# Altium schematic sheet 05 MISC.SchDoc
size 420 x 297 mm
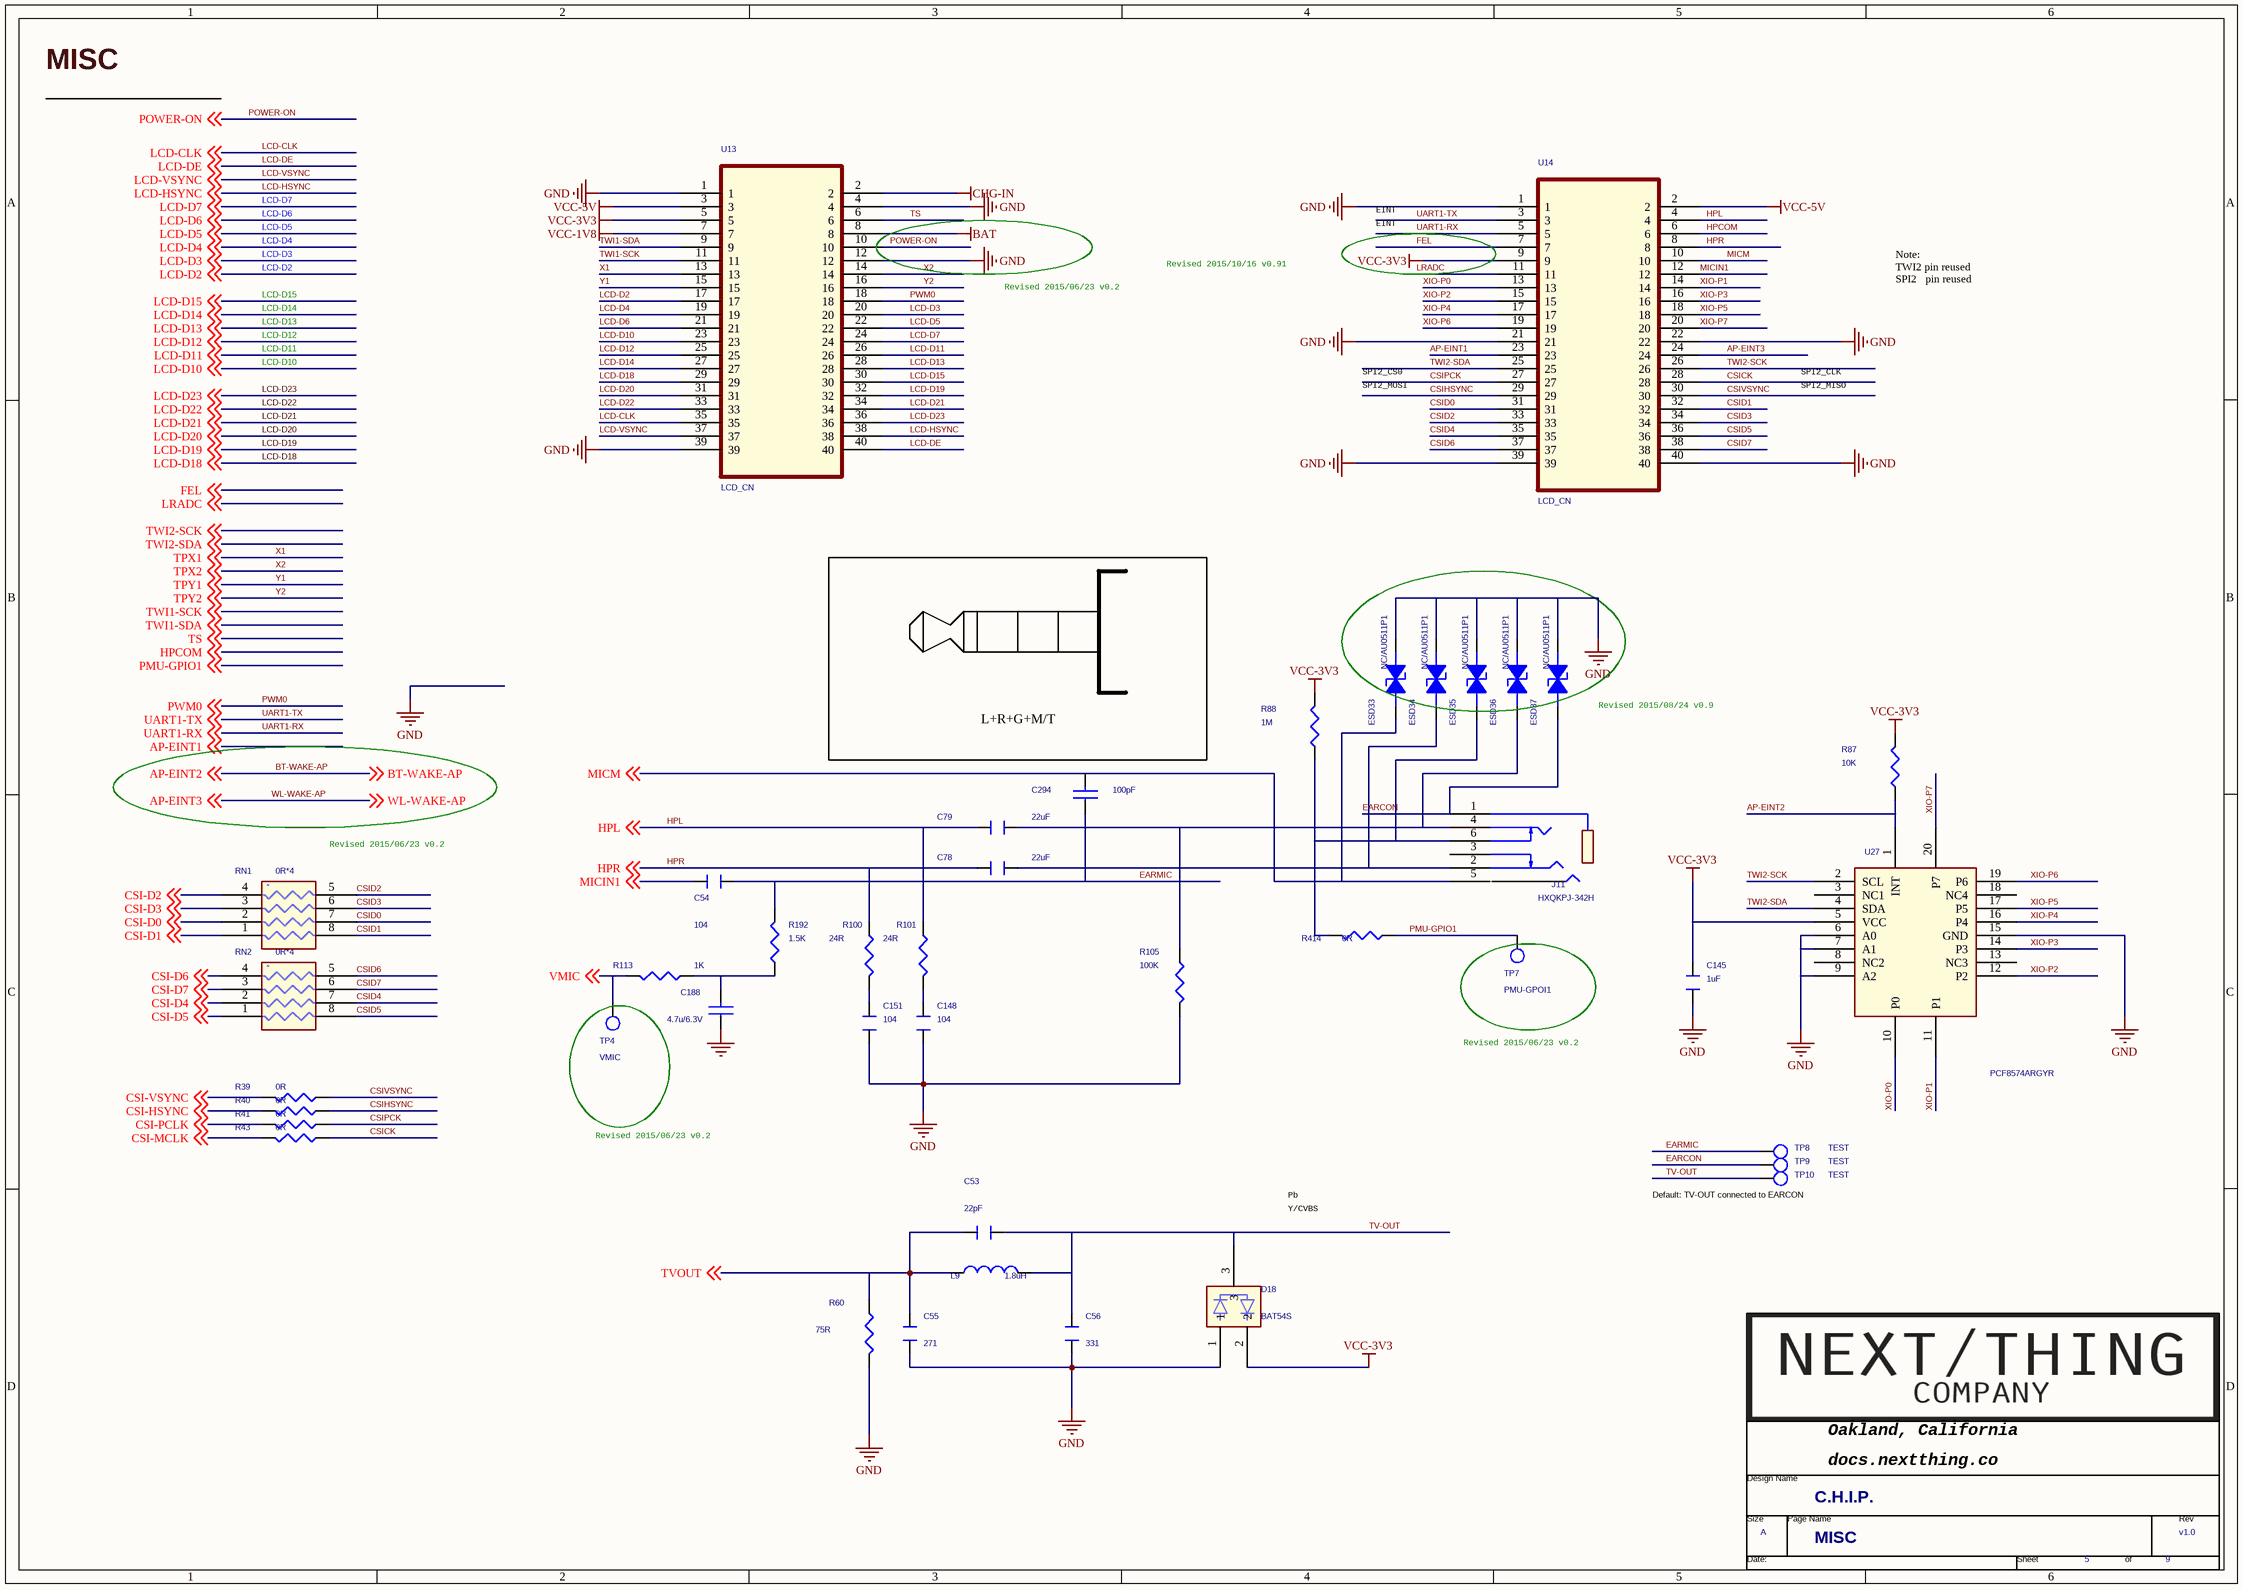
[diagram p0: 05 MISC.SchDoc]

## Parts
*  Page Count: 9  Page Number: 5  Page Size: A  Title: C.H.I.P.  RevCode: v1.0  Doc: MISC  (hidden comment: TitleBlock1-nextthing)  (graphical)
C53  22pF  [C0201]
C54  104  [C0201]
C55  271  [C0201]
C56  331  [C0201]
C78  22uF  [CC0805]
C79  22uF  [CC0805]
C145  1uF  [CC0402]
C148  104  [C0201]
C151  104  [C0201]
C188  4.7u/6.3V  [CC0603]
C294  100pF  [C0201]
D18  BAT54S  [SOT-23]
ESD33  NC/AU0511P1  [R0402]
ESD34  NC/AU0511P1  [R0402]
ESD35  NC/AU0511P1  [R0402]
ESD36  NC/AU0511P1  [R0402]
ESD37  NC/AU0511P1  [R0402]
J11  HXQKPJ-342H  [TSH-3865D]
L9  1.8uH  [L0603]
R39  0R  [R0603]
R40  0R  [R0603]
R41  0R  [R0603]
R43  0R  [R0603]
R60  75R  [C0201]
R87  10K  [C0201]
R88  1M  [C0201]
R100  24R  [R0402]
R101  24R  [R0402]
R105  100K  [R0402]
R113  1K  [C0201]
R192  1.5K  [C0201]
R414  0R  [0805]
RN1  0R*4  [RN0201]
RN2  0R*4  [RN0201]
TP4  VMIC  [TP40_SMD]
TP7  PMU-GPOI1  [TP40_SMD]
TP8  TEST  [TP30_SMD]
TP9  TEST  [TP30_SMD]
TP10  TEST  [TP30_SMD]
U13  LCD_CN  [CON2X20-PT2_54-5_2X31_2H2A]
U14  LCD_CN  [CON2X20-PT2_54-5_2X31_2H2A]
U27  PCF8574ARGYR  [SO16]

## Nets
BAT: U13.8
CHG-IN: U13.2
GND: C55.1 C56.1 C145.1 C148.2 C151.2 C188.1 D18.1 ESD33.1(ANODE) ESD34.1(ANODE) ESD35.1(ANODE) ESD36.1(ANODE) ESD37.1(ANODE) R60.2 R105.2 U13.1 U13.4 U13.12 U13.39 U14.1 U14.21 U14.22 U14.39 U14.40 U27.6(A0) U27.7(A1) U27.9(A2) U27.15(GND)
VCC-1V8: U13.7
VCC-3V3: C145.2 D18.2 R87.2 R88.2 U13.5 U14.9 U27.5(VCC)
VCC-5V: U13.3 U14.2
AP-EINT1: U14.23 ; off-sheet AP-EINT1
AP-EINT2: R87.1 U27.1(INT) ; off-sheet AP-EINT2, off-sheet BT-WAKE-AP  [also labelled BT-WAKE-AP]
AP-EINT3: U14.24 ; off-sheet AP-EINT3, off-sheet WL-WAKE-AP  [also labelled WL-WAKE-AP]
CSI-D0: RN1.2(R2) ; off-sheet CSI-D0
CSI-D1: RN1.1(R1) ; off-sheet CSI-D1
CSI-D2: RN1.4(R4) ; off-sheet CSI-D2
CSI-D3: RN1.3(R3) ; off-sheet CSI-D3
CSI-D4: RN2.2(R2) ; off-sheet CSI-D4
CSI-D5: RN2.1(R1) ; off-sheet CSI-D5
CSI-D6: RN2.4(R4) ; off-sheet CSI-D6
CSI-D7: RN2.3(R3) ; off-sheet CSI-D7
CSI-HSYNC: R40.1 ; off-sheet CSI-HSYNC
CSI-MCLK: R43.2 ; off-sheet CSI-MCLK
CSI-PCLK: R41.1 ; off-sheet CSI-PCLK
CSI-VSYNC: R39.1 ; off-sheet CSI-VSYNC
CSICK: R43.1 U14.28
CSID0: RN1.7(R7) U14.31
CSID1: RN1.8(R8) U14.32
CSID2: RN1.5(R5) U14.33
CSID3: RN1.6(R6) U14.34
CSID4: RN2.7(R7) U14.35
CSID5: RN2.8(R8) U14.36
CSID6: RN2.5(R5) U14.37
CSID7: RN2.6(R6) U14.38
CSIHSYNC: R40.2 U14.29
CSIPCK: R41.2 U14.27
CSIVSYNC: R39.2 U14.30
EARCON: ESD37.2(CATHODE) J11.1 TP9.1(TP)
EARMIC: C54.2 C294.1 R192.2 TP8.1(TP)
FEL: U14.7 ; off-sheet FEL
HPCOM: U14.6 ; off-sheet HPCOM
HPL: C79.1 R101.1 U14.4 ; off-sheet HPL
HPR: C78.1 R100.1 U14.8 ; off-sheet HPR
LCD-CLK: U13.35 ; off-sheet LCD-CLK
LCD-D2: U13.17 ; off-sheet LCD-D2
LCD-D3: U13.20 ; off-sheet LCD-D3
LCD-D4: U13.19 ; off-sheet LCD-D4
LCD-D5: U13.22 ; off-sheet LCD-D5
LCD-D6: U13.21 ; off-sheet LCD-D6
LCD-D7: U13.24 ; off-sheet LCD-D7
LCD-D10: U13.23 ; off-sheet LCD-D10
LCD-D11: U13.26 ; off-sheet LCD-D11
LCD-D12: U13.25 ; off-sheet LCD-D12
LCD-D13: U13.28 ; off-sheet LCD-D13
LCD-D14: U13.27 ; off-sheet LCD-D14
LCD-D15: U13.30 ; off-sheet LCD-D15
LCD-D18: U13.29 ; off-sheet LCD-D18
LCD-D19: U13.32 ; off-sheet LCD-D19
LCD-D20: U13.31 ; off-sheet LCD-D20
LCD-D21: U13.34 ; off-sheet LCD-D21
LCD-D22: U13.33 ; off-sheet LCD-D22
LCD-D23: U13.36 ; off-sheet LCD-D23
LCD-DE: U13.40 ; off-sheet LCD-DE
LCD-HSYNC: U13.38 ; off-sheet LCD-HSYNC
LCD-VSYNC: U13.37 ; off-sheet LCD-VSYNC
LRADC: U14.11 ; off-sheet LRADC
MICIN1: C54.1 U14.12 ; off-sheet MICIN1
MICM: C294.2 ESD33.2(CATHODE) J11.5 U14.10 ; off-sheet MICM
PMU-GPIO1: R414.1 TP7.1(TP) ; off-sheet PMU-GPIO1
POWER-ON: U13.10 ; off-sheet POWER-ON
PWM0: U13.18 ; off-sheet PWM0
TS: U13.6 ; off-sheet TS
TV-OUT: C53.2 C56.2 D18.3 L9.2 TP10.1(TP)
TVOUT: C53.1 C55.2 L9.1 R60.1 ; off-sheet TVOUT
TWI1-SCK: U13.11 ; off-sheet TWI1-SCK
TWI1-SDA: U13.9 ; off-sheet TWI1-SDA
TWI2-SCK: U14.26 U27.2(SCL) ; off-sheet TWI2-SCK
TWI2-SDA: U14.25 U27.4(SDA) ; off-sheet TWI2-SDA
UART1-RX: U14.5 ; off-sheet UART1-RX
UART1-TX: U14.3 ; off-sheet UART1-TX
VMIC: R113.2 TP4.1(TP) ; off-sheet VMIC
X1: U13.13 ; off-sheet TPX1  [also labelled TPX1]
X2: U13.14 ; off-sheet TPX2  [also labelled TPX2]
XIO-P0: U14.13 U27.10(P0)
XIO-P1: U14.14 U27.11(P1)
XIO-P2: U14.15 U27.12(P2)
XIO-P3: U14.16 U27.14(P3)
XIO-P4: U14.17 U27.16(P4)
XIO-P5: U14.18 U27.17(P5)
XIO-P6: U14.19 U27.19(P6)
XIO-P7: U14.20 U27.20(P7)
Y1: U13.15 ; off-sheet TPY1  [also labelled TPY1]
Y2: U13.16 ; off-sheet TPY2  [also labelled TPY2]
NetC78_2: C78.2 ESD34.2(CATHODE) J11.2
NetC79_2: C79.2 ESD36.2(CATHODE) J11.4 R105.1
NetC148_1: C148.1 R101.2
NetC151_1: C151.1 R100.2
NetC188_2: C188.2 R113.1 R192.1
NetESD35_2: ESD35.2(CATHODE) J11.6 R88.1 R414.2

Not connected (* = marked no-connect by the designer): J11 3; U27 3(NC1) 8(NC2) 13(NC3) 18(NC4)

## Notes on the sheet
- MISC
- EINT
- Note:
  TWI2 pin reused
  SPI2   pin reused
- Revised 2015/06/23 v0.2
- Revised 2015/10/16 v0.91
- SPI2_MOSI
- SPI2_CS0
- SPI2_MISO
- SPI2_CLK
- L+R+G+M/T
- (near ESD37) Revised 2015/08/24 v0.9
- (near RN1) Revised 2015/06/23 v0.2
- Pb
- (near TP10) Default: TV-OUT connected to EARCON
- Y/CVBS
- (in symbol TitleBlock1-nextthing) Oakland, California; Design Name; docs.nextthing.co /; Size; Page Name; Rev; Date:; Sheet; of

## Library data of the parts
C53-C56 C145 = CAPACITOR
C78 C79 = CAPACITOR_0: PAGE: 1
C148 C151 = CAPACITOR_0_Dup1: PAGE: 1
C188 = CAP NP: 0603 2.2uF X5R 6.3V +/-10%/0603 2.2uF X5R 6.3V +/-10%/0603 2.2uF X5R 6.3V +/-20%; Part Number: C0603B225K006AT/GRM185R60J225KE26/C0603B225M006AT; Singconn Part Number: EJ225K6V3631; SPREADWIN PN: C0200004A/C0200004C/C0200004D; Vendor: YIXING/MURATA/YIXING
C294 = CAP NP: 0402 100pF C0G 50V +/-5%; PART_NUMBER: GRM1555C1H180JZ01; Part Number: GRM1555C1H101JZ01/C0402CG101J050AT; Vendor: MURATA/YIXING; SPREADWIN PN: C0100019A/C0100019D
D18 = DIODE_DUAL
ESD33-ESD37 = 1_1.5KE100A: 1ST PART DESCRIPTION: WILL ESD9B5V Bidirection ESD Protection
J11 = PHONOJACK_1
L9 = INDUCTOR_1
R39-R41 R43 = RESISTOR_0
R60 = RESISTOR: ROOM: TVLCD
R87 R88 R113 R192 = RESISTOR_Dup1
R100 R101 R105 = ?_0_Dup1
R414 = R1 0805
RN1 RN2 = R-PACK4_1
TP4 TP7-TP10 = T_POINT_R_Dup1
U13 U14 = CNLCD_0
U27 = PCF8574T_1
* = TitleBlock1-nextthing: Page Create Date: March  8, 1995